# Altium schematic sheet lab2_lyaptsev_buck.SchDoc: =title_line_1 + title_line_2
size 594 x 420 mm; SheetNumber: n
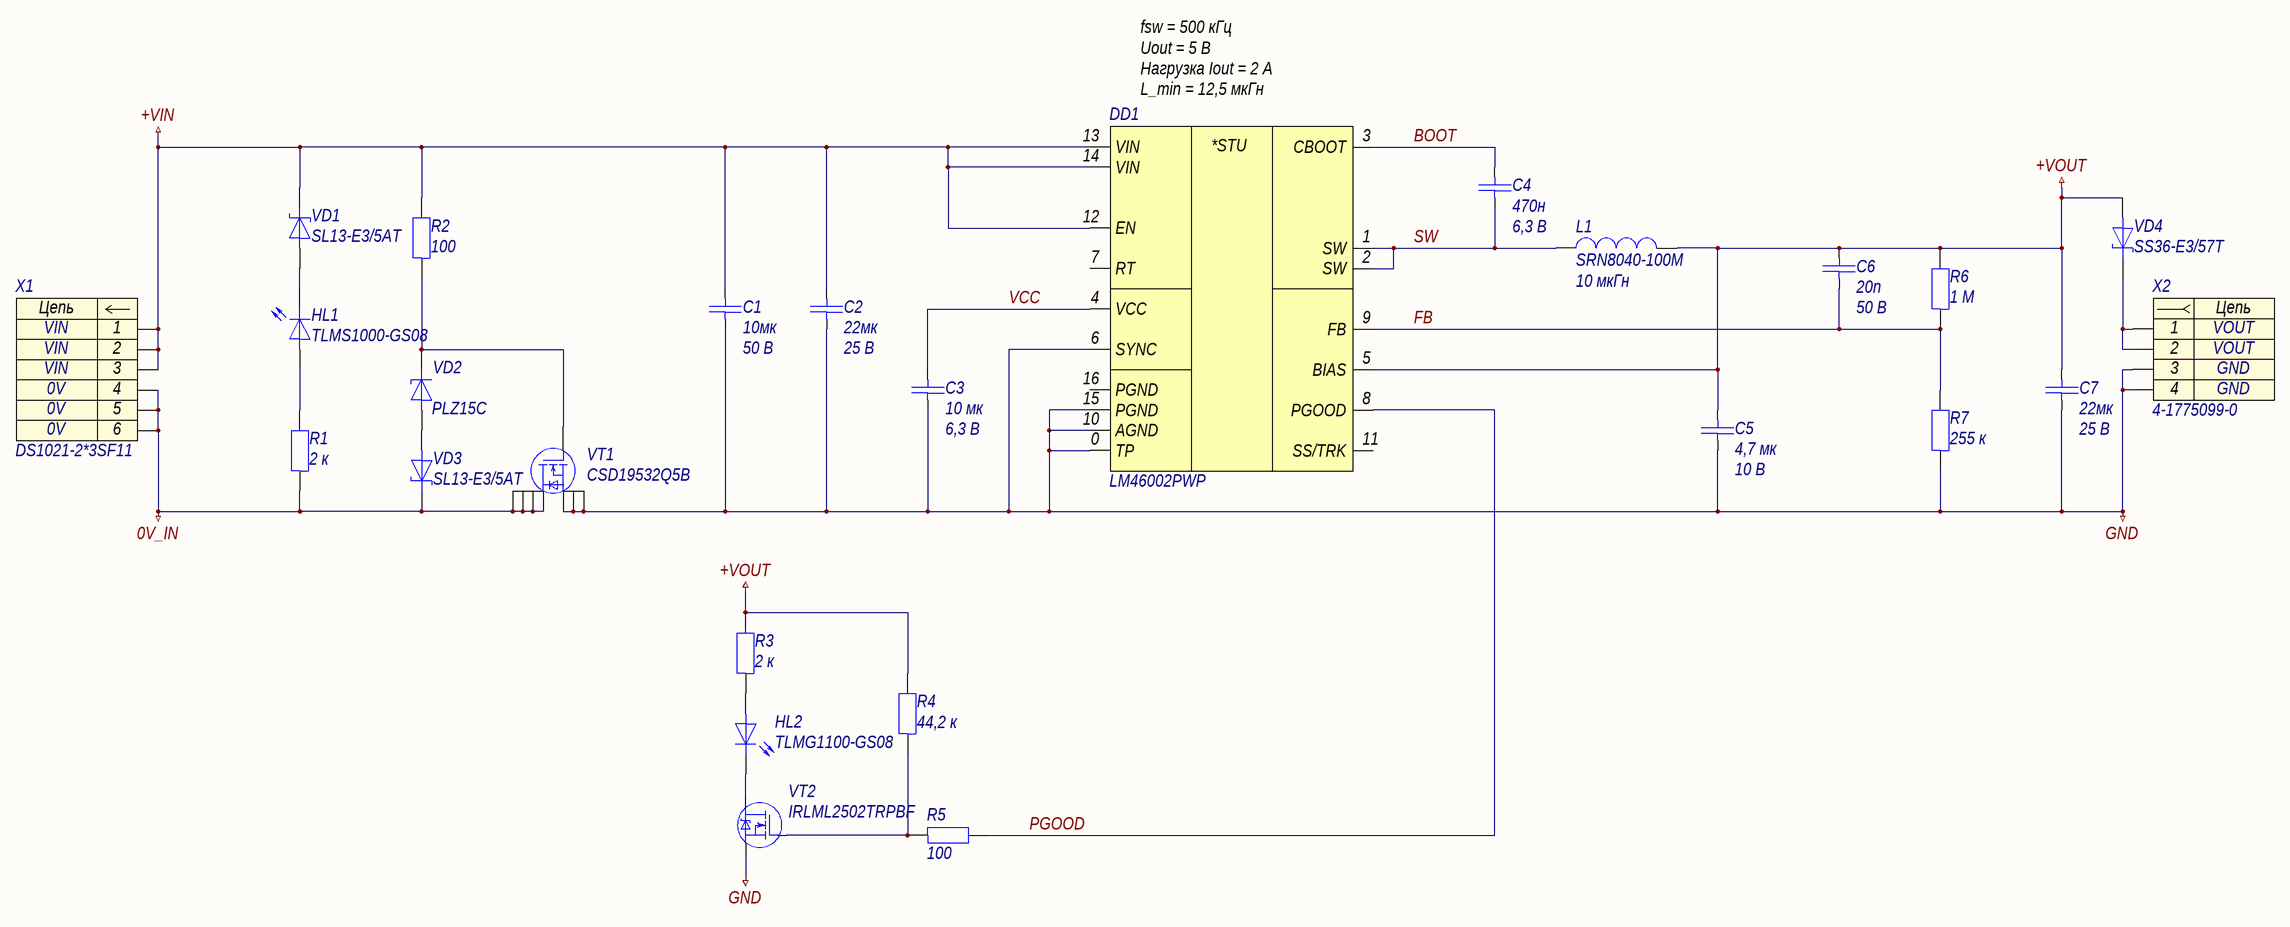
[diagram p0: lab2_lyaptsev_buck.SchDoc]

## Parts
C1  10мк  Напряжение: 50 В  [C1210]
C2  22мк  Напряжение: 25 В  [C1210]
C3  10 мк  Напряжение: 6,3 В  [C0603]
C4  470н  Напряжение: 6,3 В  [C0402]
C5  4,7 мк  Напряжение: 10 В  [C0805]
C6  20п  Напряжение: 50 В  [C0402]
C7  22мк  Напряжение: 25 В  [C1210]
DD1  LM46002PWP  [HTSSOP-16]
HL1  TLMS1000-GS08  [HL0603]
HL2  TLMG1100-GS08  [HL0603]
L1  SRN8040-100M  Индуктивность: 10 мкГн  [SRN-2-815X790X400]
R1  2 к  [R0603]
R2  100  [R0603]
R3  2 к  [R0603]
R4  44,2 к  [R0603]
R5  100  [R0603]
R6  1 М  [R0603]
R7  255 к  [R0603]
VD1  SL13-E3/5AT  [DO-214AC]
VD2  PLZ15C  [DO-219AC]
VD3  SL13-E3/5AT  [DO-214AC]
VD4  SS36-E3/57T  [DO-214AB]
VT1  CSD19532Q5B  [SON-8]
VT2  IRLML2502TRPBF  [SOT-23-3]
X1  DS1021-2*3SF11  [DS1021-2X3SF11]
X2  4-1775099-0  [4-1775099-0]

## Nets
0V_IN: R1.1 VD3.1 VT1.D X1.4 X1.5 X1.6
+VIN: C1.1 C2.1 DD1.12(EN) DD1.13(VIN) DD1.14(VIN) R2.2 VD1.1 X1.1 X1.2 X1.3
+VOUT: C5.1 C6.1 C7.1 DD1.5(BIAS) L1.2 R3.2 R4.2 R6.2 VD4.2
GND: C1.2 C2.2 C3.2 C5.2 C7.2 DD1.0(TP) DD1.6(SYNC) DD1.10(AGND) DD1.15(PGND) R7.1 VT1.S VT2.S X2.3 X2.4
BOOT: C4.1 DD1.3(CBOOT)
FB: C6.2 DD1.9(FB) R6.1 R7.2
PGOOD: DD1.8(PGOOD) R5.2
SW: C4.2 DD1.1(SW) DD1.2(SW) L1.1
VCC: C3.1 DD1.4(VCC)
NetHL1_1: HL1.1 VD1.2
NetHL1_2: HL1.2 R1.2
NetHL2_1: HL2.1 VT2.D
NetHL2_2: HL2.2 R3.1
NetR2_1: R2.1 VD2.1 VT1.G
NetR4_1: R4.1 R5.1 VT2.G
NetVD2_2: VD2.2 VD3.2
NetVD4_1: VD4.1 X2.1 X2.2

Not connected (* = marked no-connect by the designer): DD1 7(RT) 11(SS/TRK) 16(PGND)

## Notes on the sheet
- (near DD1) fsw = 500 кГц
  Uout = 5 В
  Нагрузка Iout = 2 А
  L_min = 12,5 мкГн
- Перв. примен.
- Справ. №
- Подп. и дата
- Инв. № дубл.
- Нормоконтроль:
- Взам. инв. №
- Изм.
- Лист
- № докум.
- Подп.
- Дата
- Лит.
- Масса
- Масштаб
- Т.контр.
- Пров.
- Разраб.
- Листов
- Разработал:
- Инв. № подл.
- Н.контр.
- Утв.
- Копировал
- Формат
- А2
- (in symbol dd0006) *STU
- (in symbol x0004) Цепь
- (in symbol x0005) Цепь

## Library data of the parts
C1 = с0036: =Описание; ID: с0036; Фамилия: Ляпцев; Описание: Конденсатор чип 1210 10 мкФ 50 В ±15 %; Наименование: GRM32ER71H106KA12L; Производитель: MuRata; Отклонение: ±15 %; Рабочие температуры: от -55 °С до +125 °С; Корпус: 1210; Номинал: 10мк; Номинальное напряжение: 50 В; HelpURL: https://search.murata.co.jp/Ceramy/image/img/A01X/G101/ENG/GRM32ER71H106KA12-04A.pdf
C2 = с0035: =Описание; ID: с0035; Фамилия: Ляпцев; Описание: Конденсатор чип 1210 22 мкФ 25 В ±15 %; Наименование: CC1210KKX7R8BB226; Производитель: YAGEO Corp.; Отклонение: ±15 %; Рабочие температуры: от -55 °С до +125 °С; Корпус: 1210; Номинал: 22мк; Номинальное напряжение: 25 В; HelpURL: https://www.yageo.com/upload/media/product/productsearch/datasheet/mlcc/UPY-GPHC_X7R_6.3V-to-50V_20.pdf
C3 = с0040: =Описание; ID: с0040; Фамилия: Ляпцев; Описание: Конденсатор чип 0603 10 мкФ 6,3 В ±20 %; Наименование: CC0603MRX5R5BB106; Производитель: YAGEO Corp.; Отклонение: ±20 %; Рабочие температуры: от -55 °С до +85 °С; Корпус: 0603; Номинал: 10 мк; Номинальное напряжение: 6,3 В; HelpURL: https://www.yageo.com/upload/media/product/productsearch/datasheet/mlcc/UPY-GPHC_X5R_4V-to-50V_26.pdf
C4 = с0039: =Описание; ID: с0039; Фамилия: Ляпцев; Описание: Конденсатор чип 0402 470 нФ 6,3 В ±15 %; Наименование: GRM155R60J474KE19D; Производитель: MuRata; Отклонение: ±15 %; Рабочие температуры: от -55 °С до +85 °С; Корпус: 0402; Номинал: 470н; Номинальное напряжение: 6,3 В; HelpURL: https://www.murata.com/en-sg/products/productdetail?partno=GRM155R60J474KE19%23
C5 = с0041: =Описание; ID: с0041; Фамилия: Ляпцев; Описание: Конденсатор чип 0805 4,7 мкФ 10 В ±15 %; Наименование: GRM219R61A475KE34; Производитель: MuRata; Отклонение: ±15 %; Рабочие температуры: от -55 °С до +85 °С; Корпус: 805; Номинал: 4,7 мк; Номинальное напряжение: 10 В; HelpURL: https://www.murata.com/en-global/products/productdetail?partno=GRM219R61A475KE34%23
C6 = с0038: =Описание; ID: с0038; Фамилия: Ляпцев; Описание: Конденсатор чип 0402 20 пФ 25 В ±5 %; Наименование: CC0402JRNPO9BN200; Производитель: YAGEO Corp.; Отклонение: ±5 %; Рабочие температуры: от -55 °С до +85 °С; Корпус: 0402; Номинал: 20п; Номинальное напряжение: 50 В; HelpURL: https://www.yageo.com/upload/media/product/productsearch/datasheet/mlcc/UPY-GP_NP0_16V-to-50V_18.pdf
C7 = с0037: =Описание; ID: с0037; Фамилия: Ляпцев; Описание: Конденсатор чип 1210 22 мкФ 25 В ±15 %; Наименование: GRM32ER61E226KE15L; Производитель: MuRata; Отклонение: ±15 %; Рабочие температуры: от -55 °С до +125 °С; Корпус: 1210; Номинал: 22мк; Номинальное напряжение: 25 В; HelpURL: https://search.murata.co.jp/Ceramy/image/img/A01X/G101/ENG/GRM32ER61E226KE15-01.pdf
DD1 = dd0006: =Описание; ID: dd0006; Фамилия: Ляпцев; Описание: Понижающий преобразователь напряжения 60 В и 2 А; Производитель: Texas Instruments; Входное напряжение: от 3,5 В до 60 В; Выходное напряжение: от 1 В до 28 В; Коммутируемый ток: от 0 А до 2 А; Частота переключения: от 200 кГц до 2,2 МГц; Рабочие температуры: от -40 °С до +125 °С; Наименование: LM46002PWP; Корпус: HTSSOP-16; HelpURL: https://www.ti.com/product/LM46002
HL1 = hl0001: =Описание; ID: hl0001; Фамилия: Ларионов; Описание: Светодиод чип 0603 красный; Производитель: Vishay Intertechnology, Inc.; Цвет: Red; Номинальная сила света: 4 мкд; Номинальная длина волны: 628 нм; Номинальный прямой ток: 15 мА; Номинальное падение напряжения: 1,8 В; Рассеиваемая мощность: 40 мВт; Рабочие температуры: от -40 °С до +100 °С; Корпус: 0603; Наименование: TLMS1000-GS08; HelpURL: https://www.vishay.com/leds/list/product-83172/
HL2 = hl0005: =Описание; ID: hl0005; Фамилия: Ларионов; Описание: Светодиод чип 0603 зеленый; Производитель: Vishay Intertechnology, Inc.; Цвет: Green; Номинальная сила света: 35 мкд; Номинальная длина волны: 570 нм; Номинальный прямой ток: 30 мА; Номинальное падение напряжения: 2,1 В; Рассеиваемая мощность: 90 мВт; Рабочие температуры: от -40 °С до +100 °С; Корпус: 0603; Наименование: TLMG1100-GS08; HelpURL: https://www.vishay.com/leds/list/product-83173/
L1 = l0004: =Описание; ID: l0004; Фамилия: Ляпцев; Описание: Катушка индуктивности 10 мкГн ±20 %; Производитель: Bourns, Inc.; Отклонение: ±20 %; Номинальное активное сопротивление: 50 мОм; Резонансная частота: 2,52 МГц; Номинальный ток (при нагреве на 20 °С/40 °С): 3,1 А; Ток насыщения: 3,4 А; Рабочее напряжение: не указано; Рабочие температуры: от –40 °С до +125 °С; Корпус: 8,15 х 7,9 х 4,0; Наименование: SRN8040-100M; Номинал: 10 мкГн; Максимальное активное сопротивление: 50 мОм; HelpURL: https://www.bourns.com/products/magnetic-products/power-inductors-smd-semi-shielded/product/SRN8040
R1 R3 = r0014: =Описание; ID: r0014; Фамилия: Ларионов; Описание: Резистор чип 0603 2 кОм ±1 % 0,1 Вт; Наименование: RC0603FR-072KL; Производитель: YAGEO Corp.; Отклонение: ±1 %; Номинальное напряжение: 75 В; Рабочие температуры: от -55 °С до +155 °С; Номинальный ток: 1 А; Корпус: 0603; Номинал: 2 к; HelpURL: https://www.yageo.com/upload/media/product/productsearch/datasheet/rchip/PYu-RC_Group_51_RoHS_L_11.pdf
R2 R5 = r0007: =Описание; ID: r0007; Фамилия: Самарин; Описание: Резистор чип 0603 100 Ом ±1 % 0,1 Вт; Наименование: RC0603FR‍‐07100RL; Производитель: YAGEO Corp.; Отклонение: ±1 %; Номинальное напряжение: 75 В; Рабочие температуры: от -55 °С до +155 °С; Номинальный ток: 1 А; Корпус: 0603; Номинал: 100; HelpURL: https://www.yageo.com/upload/media/product/productsearch/datasheet/rchip/PYu-RC_Group_51_RoHS_L_11.pdf
R4 = r0026: =Описание; ID: r0026; Фамилия: Ларионов; Описание: Резистор чип 0603 44,2 кОм ±1 % 0,1 Вт; Наименование: RC0603FR-0744K2L; Производитель: YAGEO Corp.; Отклонение: ±1 %; Номинальное напряжение: 75 В; Рабочие температуры: от -55 °С до +155 °С; Номинальный ток: 1 А; Корпус: 0603; Номинал: 44,2 к; HelpURL: https://www.yageo.com/upload/media/product/productsearch/datasheet/rchip/PYu-RC_Group_51_RoHS_L_11.pdf
R6 = r0038: =Описание; ID: r0038; Фамилия: Ляпцев; Описание: Резистор чип 0603 1 МОм ±1 % 75 В; Наименование: RC0603FR-071ML; Производитель: YAGEO Corp.; Отклонение: ±1 %; Номинальное напряжение: 75 В; Рабочие температуры: от -55 °С до +155 °С; Номинальный ток: 1 А; Корпус: 0603; Номинал: 1 М; HelpURL: https://www.yageo.com/upload/media/product/productsearch/datasheet/rchip/PYu-RC_Group_51_RoHS_L_11.pdf
R7 = r0039: =Описание; ID: r0039; Фамилия: Ляпцев; Описание: Резистор чип 0603 255 кОм ±1 % 75 В; Наименование: RC0603FR-07255KL; Производитель: YAGEO Corp.; Отклонение: ±1 %; Номинальное напряжение: 75 В; Рабочие температуры: от -55 °С до +155 °С; Номинальный ток: 1 А; Корпус: 0603; Номинал: 255 к; HelpURL: https://www.yageo.com/upload/media/product/productsearch/datasheet/rchip/PYu-RC_Group_51_RoHS_L_11.pdf
VD1 VD3 = vd0001: =Описание; ID: vd0001; Фамилия: Ларионов; Описание: Диод Шоттки 30 В 1,5 А; Производитель: Vishay Intertechnology, Inc.; Пиковое прямое напряжение: 0,445 В; Импульсное обратное напряжение: 30 В; Макс допустимый средний прямой ток: 1,5 А; Рабочие температуры: от -55 °С до +125 °С; Наименование: SL13-E3/5AT; Корпус: DO-214AC; HelpURL: https://www.vishay.com/product?docid=88740
VD2 = vd0003: =Описание; ID: vd0003; Фамилия: Ляпцев; Описание: Стабилитрон 15В; Производитель: Vishay Intertechnology, Inc.; Пиковое прямое напряжение: 15В; Рабочие температуры: от -40 до + 150; Наименование: PLZ15C; Корпус: DO-219AC; Корпус1: DO-219AC
VD4 = vd0004: =Описание; ID: vd0004; Фамилия: Жернаков; Описание: Диод Шоттки 60 В 3 А; Производитель: Vishay Intertechnology, Inc.; Пиковое прямое напряжение: 0,75 В; Импульсное обратное напряжение: 60 В; Макс допустимый средний прямой ток: 3 А; Рабочие температуры: от –55 °С до +150 °С; Наименование: SS36-E3/57T; Корпус: DO-214AB; HelpURL: https://www.vishay.com/product?docid=88751
VT1 = vt0001: =Описание; ID: vt0001; Фамилия: Жернаков; Описание: Транзистор полевой N-канальный 100 В 17 А; Производитель: Texas Instruments; Напряжение затвор-исток: ±20 В; Напряжение сток-исток: 100 В; Ток стока: 17 А; Сопротивление сток-исток: 0,0057 Ом; Рабочие температуры: от -55 °С до +150 °С; Наименование: CSD19532Q5B; Корпус: SON-8; HelpURL: https://www.ti.com/product/CSD19532Q5B?keyMatch=CSD19532Q5B&tisearch=Search-EN-everything&usecase=OPN
VT2 = vt0002: =Описание; ID: vt0002; Фамилия: Паньков; Описание: Транзистор полевой N-канальный 20 В 4,2 А; Производитель: Infineon Technologies AG; Напряжение затвор — исток: ±12 В; Напряжение сток — исток: 20 В; Ток стока: 4,2 А; Сопротивление сток — исток: 0,080 Ом; Рабочие температуры: от –55 °С до +150 °С; Наименование: IRLML2502TRPBF; Корпус: SOT-23-3; HelpURL: https://www.infineon.com/cms/en/product/power/mosfet/12v-300v-n-channel-power-mosfet/irlml2502/
X1 = x0005: =Описание; Contact_1: VIN; Contact_4: 0V; ID: x0005; Фамилия: Самарин; Описание: PLS 3x2 pin 2,54 мм вилка прямой; Производитель: Connfly Electronic Co. LTD.; Contact_2: VIN; Contact_3: VIN; Contact_5: 0V; Contact_6: 0V; Наименование: DS1021-2*3SF11; HelpURL: http://www.connfly.com/productshow.aspx?id=118
X2 = x0004: =Описание; Contact_1: VOUT; Contact_3: GND; ID: x0004; Фамилия: Ларионов; Описание: ATX Power 4 pin гнездо прямой; Производитель: TE Connectivity; Contact_2: VOUT; Contact_4: GND; Наименование: 4-1775099-0; HelpURL: https://www.te.com/usa-en/product-4-1775099-0.html